# EAGLE design TubeBoard (EAGLE 9.1.3)
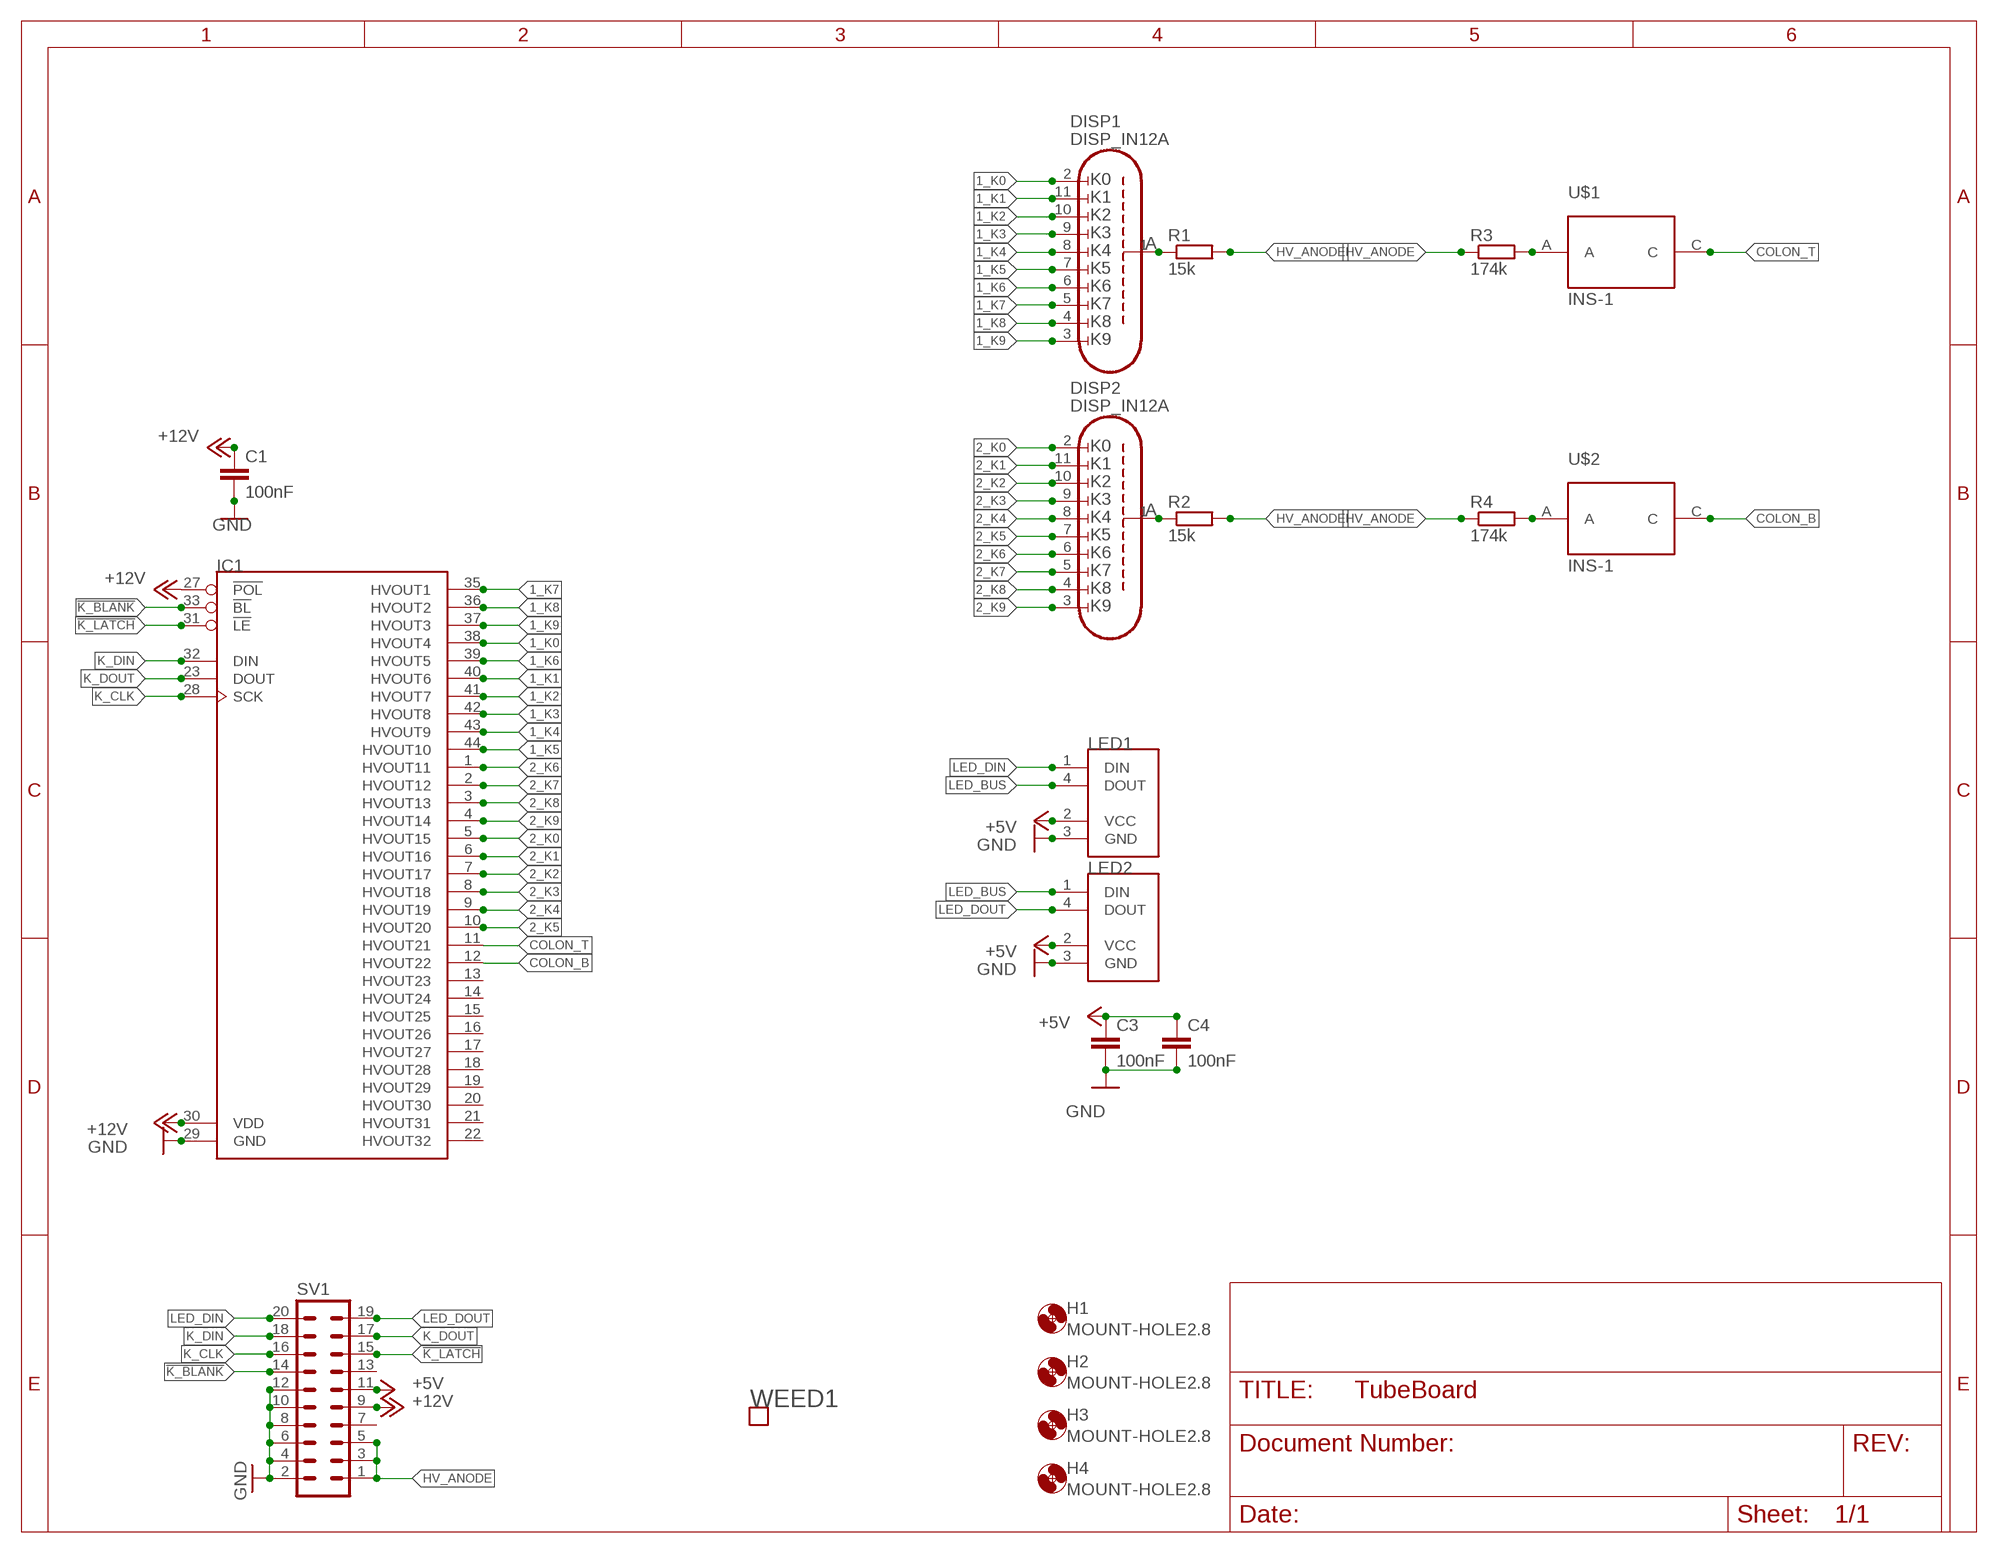
[diagram p0: schematic, sheet 1]

## Parts
C1  100nF  C-EUC1206  [C1206]
C3  100nF  C-EUC1206  [C1206]
C4  100nF  C-EUC1206  [C1206]
DISP1  DISP_IN12A  [DISP_IN-12_SOCKET]
DISP2  DISP_IN12A  [DISP_IN-12_SOCKET]
H1  MOUNT-HOLE2.8  [2,8]
H2  MOUNT-HOLE2.8  [2,8]
H3  MOUNT-HOLE2.8  [2,8]
H4  MOUNT-HOLE2.8  [2,8]
IC1  HV5530PQFP-44  [PQFP44]
LED1  NEOPIXEL-5MMLED-4PIN  [LED5MMRGB]
LED2  NEOPIXEL-5MMLED-4PIN  [LED5MMRGB]
R1  15k  R-EU_0411/12  [0411/12]
R2  15k  R-EU_0411/12  [0411/12]
R3  174k  R-EU_M1206  [M1206]
R4  174k  R-EU_M1206  [M1206]
SV1  MA10-2  [MA10-2]
U$1  INS-1  [INS-1]
U$2  INS-1  [INS-1]
WEED1  WEED  [DOINK]

## Nets
1_K0: DISP1.2(K0) IC1.38(HVOUT4)
1_K1: DISP1.11(K1) IC1.40(HVOUT6)
1_K2: DISP1.10(K2) IC1.41(HVOUT7)
1_K3: DISP1.9(K3) IC1.42(HVOUT8)
1_K4: DISP1.8(K4) IC1.43(HVOUT9)
1_K5: DISP1.7(K5) IC1.44(HVOUT10)
1_K6: DISP1.6(K6) IC1.39(HVOUT5)
1_K7: DISP1.5(K7) IC1.35(HVOUT1)
1_K8: DISP1.4(K8) IC1.36(HVOUT2)
1_K9: DISP1.3(K9) IC1.37(HVOUT3)
2_K0: DISP2.2(K0) IC1.5(HVOUT15)
2_K1: DISP2.11(K1) IC1.6(HVOUT16)
2_K2: DISP2.10(K2) IC1.7(HVOUT17)
2_K3: DISP2.9(K3) IC1.8(HVOUT18)
2_K4: DISP2.8(K4) IC1.9(HVOUT19)
2_K5: DISP2.7(K5) IC1.10(HVOUT20)
2_K6: DISP2.6(K6) IC1.1(HVOUT11)
2_K7: DISP2.5(K7) IC1.2(HVOUT12)
2_K8: DISP2.4(K8) IC1.3(HVOUT13)
2_K9: DISP2.3(K9) IC1.4(HVOUT14)
!K_BLANK: IC1.33(!BL) SV1.14
!K_LATCH: IC1.31(!LE) SV1.15
+5V: C3.1 C4.1 LED1.2(VCC) LED2.2(VCC) SV1.11
+12V: C1.1 IC1.27(!POL) IC1.30(VDD) SV1.9
COLON_B: IC1.12(HVOUT22) U$2.C
COLON_T: IC1.11(HVOUT21) U$1.C
GND: C1.2 C3.2 C4.2 IC1.29(GND) LED1.3(GND) LED2.3(GND) SV1.2 SV1.4 SV1.6 SV1.8 SV1.10 SV1.12
HV_ANODE: R1.2 R2.2 R3.1 R4.1 SV1.1 SV1.3 SV1.5
K_CLK: IC1.28(SCK) SV1.16
K_DIN: IC1.32(DIN) SV1.18
K_DOUT: IC1.23(DOUT) SV1.17
LED_BUS: LED1.4(DOUT) LED2.1(DIN)
LED_DIN: LED1.1(DIN) SV1.20
LED_DOUT: LED2.4(DOUT) SV1.19
N$1: DISP1.1(ANODE) R1.1
N$2: DISP2.1(ANODE) R2.1
N$3: R3.2 U$1.A
N$4: R4.2 U$2.A
Unconnected: IC1.13(HVOUT23) IC1.14(HVOUT24) IC1.15(HVOUT25) IC1.16(HVOUT26) IC1.17(HVOUT27) IC1.18(HVOUT28) IC1.19(HVOUT29) IC1.20(HVOUT30) IC1.21(HVOUT31) IC1.22(HVOUT32) SV1.7 SV1.13

## Library data of the parts
C1 C3 C4 = rcl:C-EU: CAPACITOR, European symbol; SPICEPREFIX: C
DISP1 DISP2 = dp_devices:DISP_IN12A: IN-12A Nixie Display
H1-H4 = holes:MOUNT-HOLE: MOUNTING HOLE with drill center marker
IC1 = Parts:HV5530: HV5530 32-Channel, Serial to Parallel Converter w/ Open Drain Outputs, 300V Information <https://www.microchip.com/wwwproducts/en/HV5530>; MOUER: 689-HV5530PG-G
LED1 LED2 = Parts:NEOPIXEL-5MM
R1 R2 = rcl:R-EU_: RESISTOR, European symbol; MOUER: 588-OM1535E-R58; SPICEPREFIX: R
R3 R4 = rcl:R-EU_: RESISTOR, European symbol; MOUSER: 667-ERJ-8ENF1743V; SPICEPREFIX: R
SV1 = con-lstb:MA10-2: PIN HEADER; OC_FARNELL: unknown; OC_NEWARK: unknown
U$1 U$2 = Parts:INS-1
WEED1 = Parts:WEED

## Board
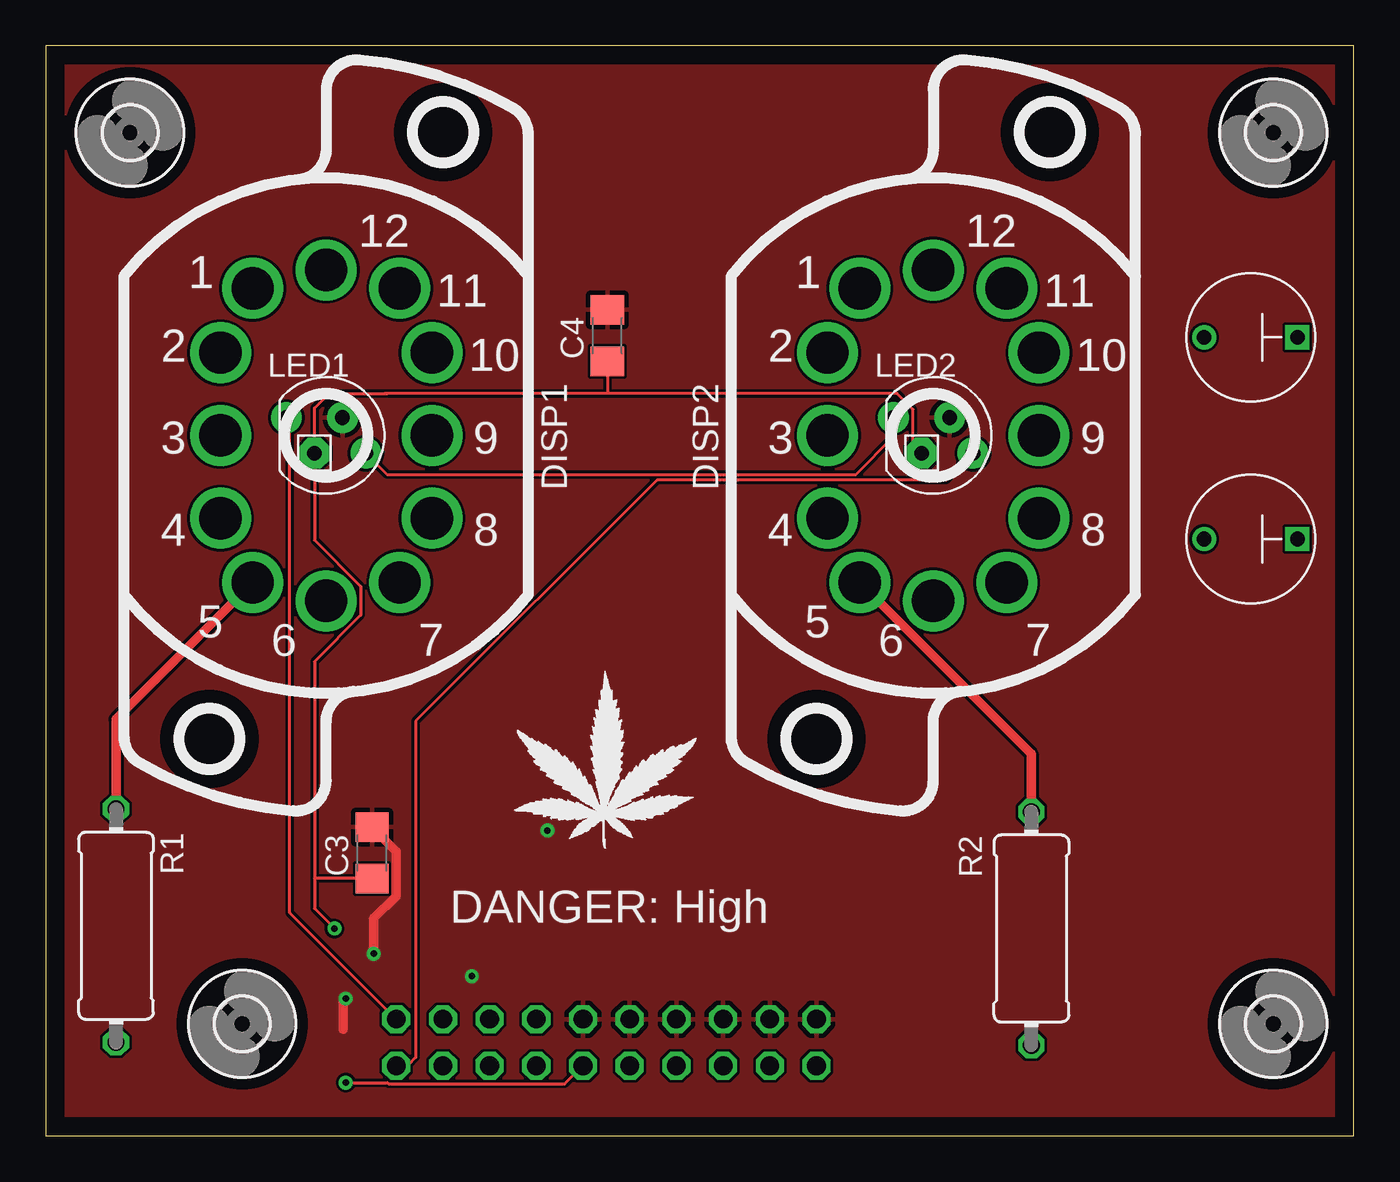
[diagram p1: board, top side]
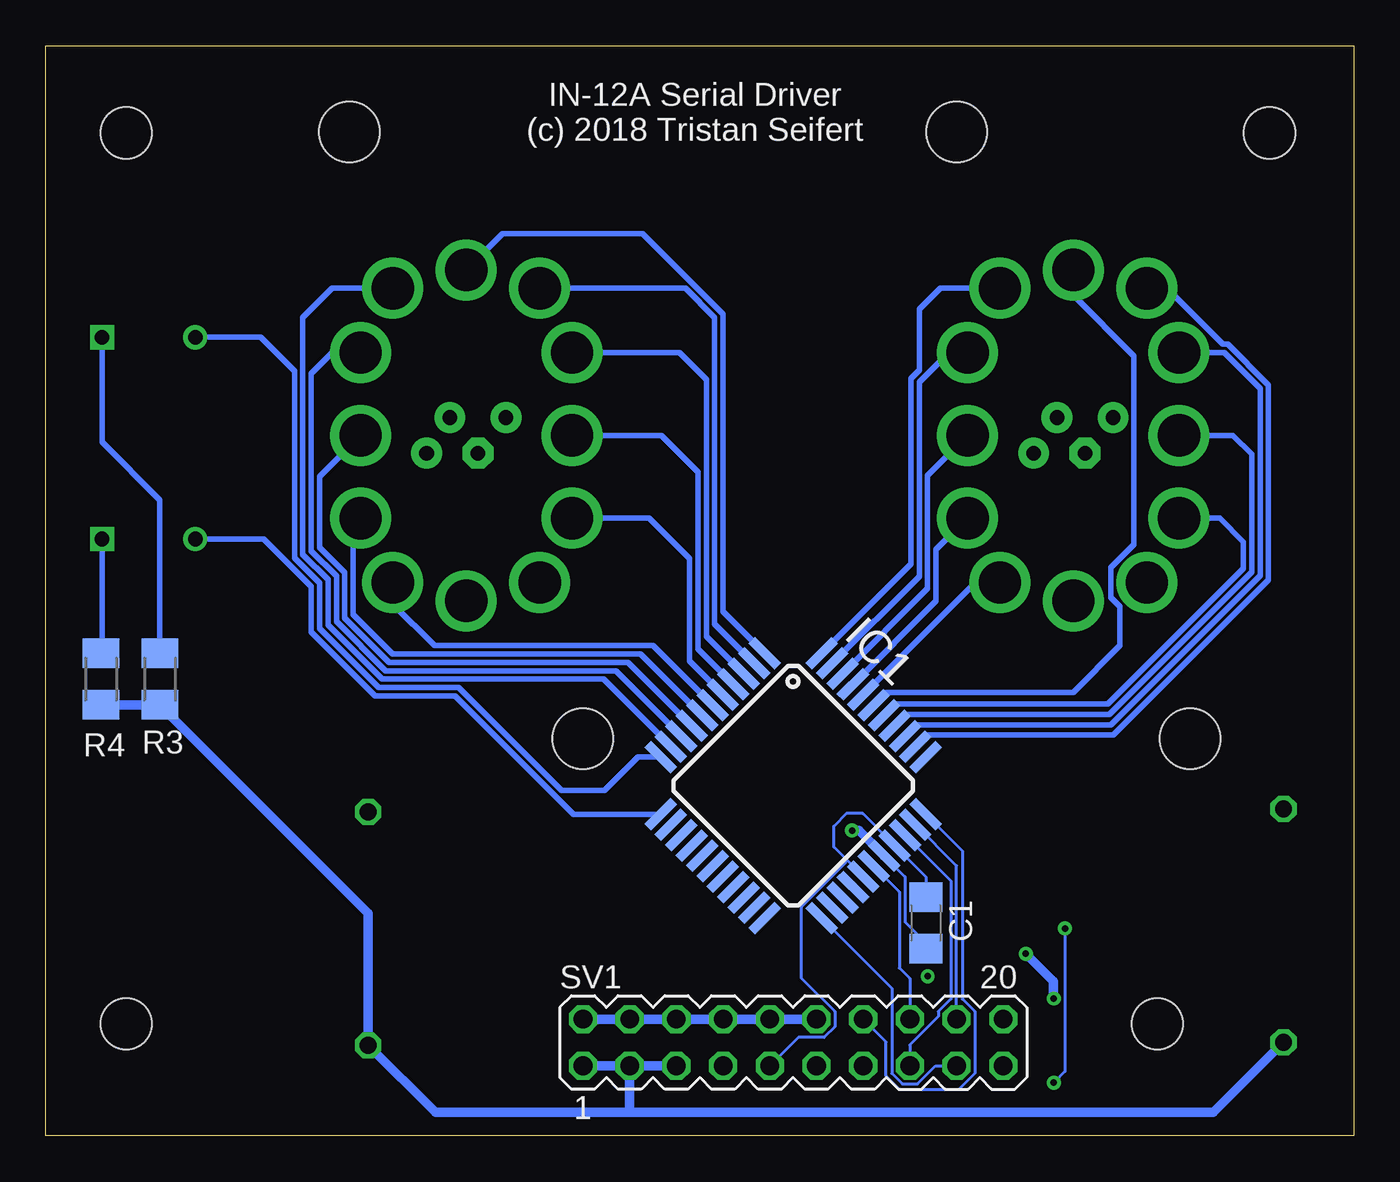
[diagram p2: board, bottom side, seen from below]

Size 71.12 x 59.28 mm. Coordinates in mm from the lower left corner, seen from the top.
Outline: 0,0 71.12,0 71.12,59.28 0,59.28 0,0
Copper layers (1*16): Top 0.035mm / dielectric 1.5mm / Bottom 0.035mm
Design rules "default": minimum track width 6mil, minimum drill 0.35mm, track to track 6mil, track to pad 6mil, pad to pad 6mil, via to via 6mil, smd to smd 6mil, copper to edge 40mil, drill to drill 6mil, minimum pad ring 10mil, minimum via ring 8mil, stop-mask expansion 4mil, vias tented up to drill 0mil, thermal gap 10mil

### Footprints (pad centres in the part's own frame; a part is rotated, then mirrored left to right if it is on the bottom)
C1206 = smd 1.6 x 1.8: 1 -1.4,0; 2 1.4,0
DISP_IN-12_SOCKET = drill 2.3: 1 -4,-8; 2 -5.75,-4.5; 3 -5.75,0; 4 -5.75,4.5; 5 -4,8; 6 0,9; 7 4,8; 8 5.75,4.5; 9 5.75,0; 10 5.75,-4.5; 11 4,-8; 12 0,-9 | hole 3.3: 6.35,16.5; -6.35,-16.5
2,8 = hole 2.8: 0,0
PQFP44 = smd 2 x 0.5: 1 -6.2,4; 2 -6.2,3.2; 3 -6.2,2.4; 4 -6.2,1.6; 5 -6.2,0.8; 6 -6.2,0; 7 -6.2,-0.8; 8 -6.2,-1.6; 9 -6.2,-2.4; 10 -6.2,-3.2; 11 -6.2,-4; 23 6.2,-4; 24 6.2,-3.2; 25 6.2,-2.4; 26 6.2,-1.6; 27 6.2,-0.8; 28 6.2,0; 29 6.2,0.8; 30 6.2,1.6; 31 6.2,2.4; 32 6.2,3.2; 33 6.2,4 | smd 0.5 x 2: 12 -4,-6.2; 13 -3.2,-6.2; 14 -2.4,-6.2; 15 -1.6,-6.2; 16 -0.8,-6.2; 17 0,-6.2; 18 0.8,-6.2; 19 1.6,-6.2; 20 2.4,-6.2; 21 3.2,-6.2; 22 4,-6.2; 34 4,6.2; 35 3.2,6.2; 36 2.4,6.2; 37 1.6,6.2; 38 0.8,6.2; 39 0,6.2; 40 -0.8,6.2; 41 -1.6,6.2; 42 -2.4,6.2; 43 -3.2,6.2; 44 -4,6.2
LED5MMRGB = drill 0.8 pad 1.676: 1 -2.159,0.968; 3 0.889,0.968; 4 2.159,-0.968 | drill 0.8 pad 1.676 octagon: 2 -0.635,-0.968
0411/12 = drill 0.914 octagon: 1 -6.35,0; 2 6.35,0
M1206 = smd 1.6 x 2: 1 -1.4,0; 2 1.4,0
MA10-2 = drill 1.016 octagon: 1 -11.43,-1.27; 2 -11.43,1.27; 3 -8.89,-1.27; 4 -8.89,1.27; 5 -6.35,-1.27; 6 -6.35,1.27; 7 -3.81,-1.27; 8 -3.81,1.27; 9 -1.27,-1.27; 10 -1.27,1.27; 11 1.27,-1.27; 12 1.27,1.27; 13 3.81,-1.27; 14 3.81,1.27; 15 6.35,-1.27; 16 6.35,1.27; 17 8.89,-1.27; 18 8.89,1.27; 19 11.43,-1.27; 20 11.43,1.27
INS-1 = drill 0.8 square: A 0,2.54 | drill 0.8: C 0,-2.54

### Placement (x,y rotation side)
C1  23.27,11.58 270 bottom
C3  17.73,15.39 90 top
C4  30.53,43.54 90 top
DISP1  15.24,38.1 0 top
DISP2  48.26,38.1 0 top
H1  10.67,6.1 0 top
H2  66.75,6.1 0 top
H3  4.57,54.56 0 top
H4  66.75,54.56 0 top
IC1  30.48,19.05 315 bottom
LED1  15.24,38.1 0 top
LED2  48.26,38.1 0 top
R1  3.81,11.43 270 top
R2  53.59,11.28 270 top
R3  64.92,24.84 90 bottom
R4  68.12,24.84 90 bottom
SV1  30.48,5.08 0 bottom
U$1  65.53,43.43 270 top
U$2  65.53,32.46 270 top
WEED1  25.45,15.54 0 top

### Tracks (layer width: path | path; a pad name or v marks a point on that pad's centre or on a via)
1_K0
  Bottom 0.305: 24.56,23.49 24.38,23.49 | 24.38,23.49 13.36,23.49 5.99,30.86 5.99,32.31 7.29,33.6 DISP1.2 | IC1.38 24.91,23.49 24.38,23.49
1_K1
  Bottom 0.305: IC1.40 20.56,30.1 DISP1.11
1_K2
  Bottom 0.305: DISP1.10 22.71,31.88 22.71,29.72 22.71,29.09 IC1.41
1_K3
  Bottom 0.305: DISP1.9 23.16,35.92 23.16,31.24 23.16,29.76 IC1.42
1_K4
  Bottom 0.305: IC1.43 23.62,30.43 23.62,41 22.02,42.6 DISP1.8
1_K5
  Bottom 0.305: IC1.44 24.08,31.11 24.08,41.19 23.62,41.64 23.62,44.96 22.48,46.1 DISP1.7
1_K6
  Bottom 0.305: DISP1.6 15.24,45.72 11.94,42.42 11.94,32.18 13.2,30.91 13.2,29.29 12.7,28.78 12.7,26.67 15.24,24.13 25.4,24.13 IC1.39
1_K7
  Bottom 0.305: DISP1.5 10.16,46.1 7.12,43.06 6.85,43.06 4.68,40.89 | 4.62,40.83 4.68,40.89 | 8.65,26.21 8.74,26.12 | 8.74,26.12 13.07,21.79 23.21,21.79 IC1.35 | 4.68,40.89 4.62,40.83 | 4.62,40.83 4.62,30.24 8.74,26.12
1_K8
  Bottom 0.305: 23.43,22.36 23.16,22.36 | 23.16,22.36 13.2,22.36 5.08,30.48 5.08,40.64 7.04,42.6 DISP1.4 | IC1.36 23.78,22.36 23.16,22.36
1_K9
  Bottom 0.305: IC1.37 24.34,22.93 13.28,22.93 5.54,30.67 5.54,37.08 6.55,38.1 DISP1.3
2_K0
  Bottom 0.305: IC1.5 36.12,25.82 36.12,31.39 38.32,33.6 DISP2.2
2_K1
  Bottom 0.305: IC1.6 38.1,26.67 49.99,26.67 52.26,28.94 DISP2.11
2_K2
  Bottom 0.305: IC1.7 38.77,26.21 52.27,26.21 54.41,28.35 54.41,33.2 DISP2.10
2_K3
  Bottom 0.305: IC1.8 39.45,25.76 52.46,25.76 54.86,28.16 54.86,30.63 56.24,32 56.24,35.87 DISP2.9
2_K4
  Bottom 0.305: IC1.9 40.12,25.3 52.65,25.3 55.32,27.97 55.32,30.44 56.69,31.82 56.69,41.45 55.55,42.6 DISP2.8
2_K5
  Bottom 0.305: IC1.10 40.8,24.84 52.84,24.84 55.78,27.78 55.78,30.25 57.15,31.62 57.15,44.5 55.55,46.1 DISP2.7
2_K6
  Bottom 0.305: IC1.1 34.29,28.52 34.29,44.69 38.67,49.07 46.29,49.07 DISP2.6
2_K7
  Bottom 0.305: IC1.2 34.75,27.84 34.75,44.5 36.35,46.1 DISP2.5
2_K8
  Bottom 0.305: IC1.3 35.2,27.17 35.2,41.15 36.66,42.6 DISP2.4
2_K9
  Bottom 0.305: IC1.4 35.66,26.49 35.66,36.12 37.64,38.1 DISP2.3
!K_BLANK
  Bottom 0.152: IC1.33 21.29,15.51 21.29,7.45 20.6,6.76 20.6,3.4 21.48,2.52 24.67,2.52 25.43,3.27 25.43,5.11 SV1.14
!K_LATCH
  Bottom 0.152: SV1.15 24.13,4.95 23.23,5.85 | 23.14,5.94 23.23,5.85 | 23.23,5.85 22.58,6.5 22.58,6.76 21.89,7.45 21.89,13.86 IC1.31
+5V  (via drill 0.35)
  Top 0.152: v15.7,11.28 14.61,12.37 14.61,14.02 | 14.61,14.02 14.61,25.8 17.13,28.32 17.13,29.88 14.61,32.4 LED1.2 14.61,39.6 15.39,40.39 18.59,40.39 | v16.31,2.9 18.56,2.9 18.64,2.82 28.22,2.82 SV1.11 | C3.1 14.63,13.99 14.61,14.02 | LED2.2 47.17,37.59 47.17,39.51 46.29,40.39 41,40.39 | 41,40.39 40.08,40.39 | 41,40.39 30.48,40.39 | 30.48,40.39 18.59,40.39 | 18.59,40.39 18.44,40.39 | C4.1 30.53,40.44 30.48,40.39
  Bottom 0.152: v15.7,11.28 15.7,3.5 v16.31,2.9
+12V
  Bottom 0.152: SV1.9 30.2,5.36 28.8,5.36 28.22,5.94 28.22,6.76 30.04,8.58 30.04,12.46 27.62,14.88 27.62,15.05 | C1.1 23.27,14.1 IC1.30 26.69,17.53 27.58,17.53 28.27,16.84 28.27,15.71 27.62,15.05 | IC1.27 27.62,15.05
COLON_B
  Bottom 0.305: IC1.12 42.44,17.49 48.87,23.93 53.22,23.93 56.69,27.4 56.69,29.88 59.28,32.46 U$2.C
COLON_T
  Bottom 0.305: IC1.11 38.92,20.61 40.74,18.78 43.08,18.78 48.68,24.38 53.03,24.38 56.24,27.59 56.24,30.06 57.61,31.44 57.61,41.6 59.44,43.43 U$1.C
GND  (via drill 0.35)
  Top 0.508: v17.83,9.91 17.83,11.82 19.04,13.02 19.04,15.49 C3.2 | v16.3,7.47 16.15,7.32 16.15,5.79
  Bottom 0.152: IC1.29 24.39,14.1 24.39,11.63 23.27,10.5 C1.2 | v27.28,16.61 26.91,16.61
  Bottom 0.508: SV1.2 SV1.4 SV1.6 SV1.8 SV1.10 SV1.12 | IC1.29 26.91,16.61 | v17.83,9.91 16.33,8.41 16.33,7.5 v16.3,7.47
  other vias: 23.16,8.69
  pour Top: 0,0 0,59.28 71.12,59.28 71.12,0
HV_ANODE
  Bottom 0.305: 68.7,23.44 R4.1 68.7,23.44 | 68.7,23.44 68.73,23.47 68.7,23.44
  Bottom 0.508: SV1.5 SV1.3 | SV1.3 SV1.1 | R1.2 7.62,1.27 39.37,1.27 | 39.37,1.27 SV1.3 | 39.37,1.27 49.94,1.27 R2.2 53.59,12.11 R3.1 R4.1
K_CLK
  Bottom 0.152: IC1.28 24.7,13.27 24.7,9.13 24.13,8.57 SV1.16
K_DIN
  Bottom 0.152: SV1.18 21.59,14.69 IC1.32
K_DOUT
  Bottom 0.152: IC1.23 25.12,8.03 25.12,3.4 24.54,2.82 23.72,2.82 22.73,3.81 SV1.17
LED_BUS
  Top 0.152: LED1.4 18.56,35.97 44.04,35.97 46.1,38.02 LED2.1
LED_DIN
  Top 0.152: SV1.20 13.26,12.14 13.26,38.89 LED1.1
LED_DOUT
  Top 0.152: LED2.4 48.95,35.66 33.22,35.66 20.12,22.55 20.12,4.27 19.66,3.81 SV1.19
N$1
  Top 0.508: DISP1.1 3.81,22.67 R1.1
N$2
  Top 0.508: DISP2.1 53.59,20.77 R2.1
N$3
  Bottom 0.305: R3.2 64.92,28.04 | 64.92,28.04 64.92,28.19 | 64.92,28.19 | U$1.A 68.07,37.74 64.92,34.59 64.92,28.04
N$4
  Bottom 0.305: U$2.A 68.07,26.29 R4.2

### Text on the board
tNames: ↯ DANGER: High ↯
bNames: IN-12A Serial Driver / (c) 2018 Tristan Seifert